# Altium project rttl2rs232.PrjPcb
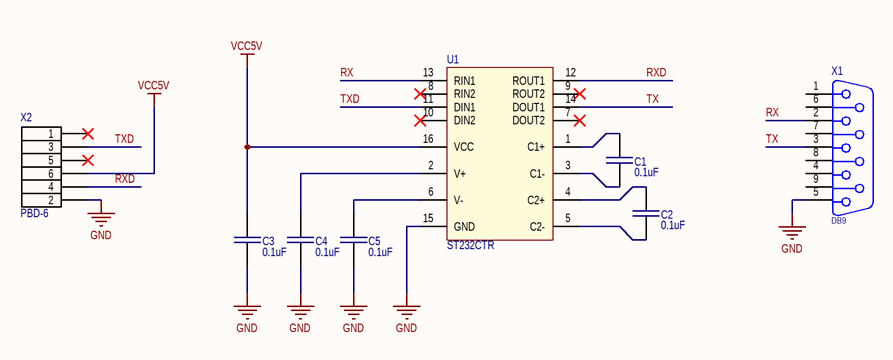
[diagram p0: ttl2rs232.SchDoc]
1 sheet, 8 parts. Net scope: global (net labels, ports and power ports of the same name join across sheets).
Board file: PCB.PcbDoc

## Sheet ttl2rs232.SchDoc
size 209 x 297 mm; SheetNumber: 1; SheetTotal: 1

### Parts
C1  0.1uF  [C_0603]
C2  0.1uF  [C_0603]
C3  0.1uF  [C_0603]
C4  0.1uF  [C_0603]
C5  0.1uF  [C_0603]
U1  ST232CTR  [TSSOP16_STM]
X1  DB9  [DB9_template]  (no BOM)
X2  PBD-6  [PBD-6-sideways]

### Nets
GND: C3.1 C4.1 C5.1 U1.15(GND) X1.5 X2.2
VCC5V: C3.2 U1.16(VCC) X2.6
RX: U1.13(RIN1) X1.2
RXD: U1.12(ROUT1) X2.4
TX: U1.14(DOUT1) X1.3
TXD: U1.11(DIN1) X2.3
NetC1_1: C1.1 U1.1(C1+)
NetC1_2: C1.2 U1.3(C1-)
NetC2_1: C2.1 U1.4(C2+)
NetC2_2: C2.2 U1.5(C2-)
NetC4_2: C4.2 U1.2(V+)
NetC5_2: C5.2 U1.6(V-)

Not connected (* = marked no-connect by the designer): U1 7(DOUT2)* 8(RIN2)* 9(ROUT2)* 10(DIN2)*; X1 1 4 6 7 8 9; X2 1* 5*

### Library data of the parts
C1-C5 = C0603: Capacitor; Part Number: CC0603KPX7R9BB104; Value: 0.1uF
U1 = ST232CTR: No Description Available; Mfr_Name: STMicroelectronics; Copyright: Copyright (C) 2022 Ultra Librarian. All rights reserved.; Part Number: ST232CTR; RefDes: RefDes; Type: DEV
X1 = DB9_template: Connector
X2 = PBD-6: Header, 6-Pin, Dual row; Part Number: PBD-6